# EAGLE schematic controller_unit (EAGLE 9.3.1)
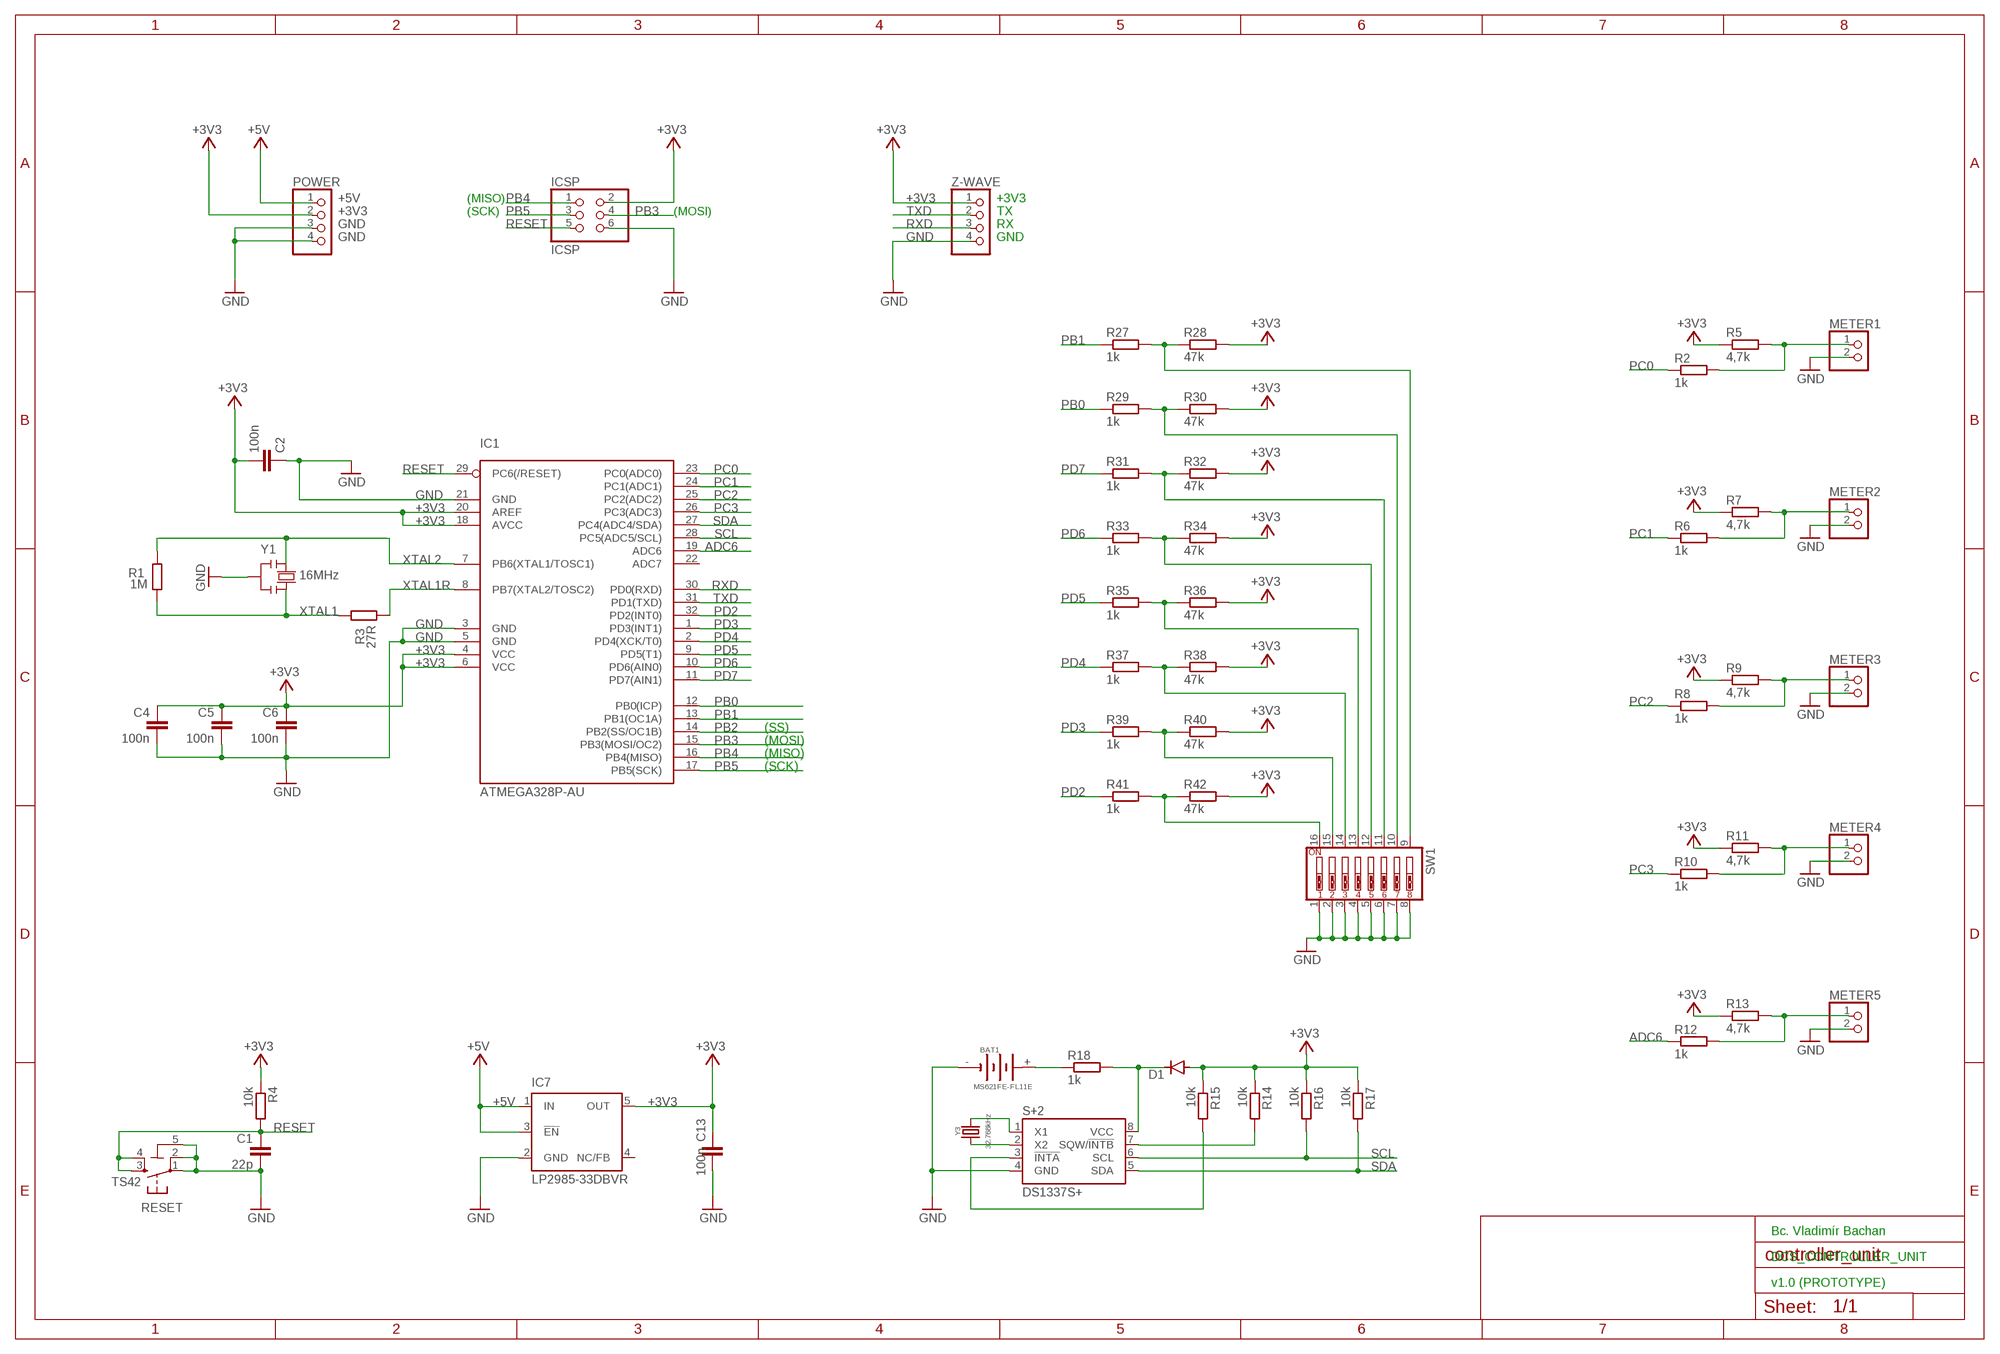
[diagram p0: schematic, sheet 1]

## Parts
BAT1  MS621FE-FL11E  [MS621FEFL11E]
C1  22p  C-EU0603-RND  [C0603-ROUND]
C2  100n  C-EU0603-RND  [C0603-ROUND]
C4  100n  C-EU0603-RND  [C0603-ROUND]
C5  100n  C-EU0603-RND  [C0603-ROUND]
C6  100n  C-EU0603-RND  [C0603-ROUND]
C13  100n  C-EU0603-RND  [C0603-ROUND]
D1  1N4148DO35-7  [DO35-7]
IC1  MEGA8-AI  [TQFP32-08]
IC7  LP2985-33DBVR  TPS77033  [SOT23-DBV]
ICSP  ICSP  PINHD-2X3  [2X03]
METER1  PINHD-1X2  [1X02]
METER2  PINHD-1X2  [1X02]
METER3  PINHD-1X2  [1X02]
METER4  PINHD-1X2  [1X02]
METER5  PINHD-1X2  [1X02]
POWER  PINHD-1X4  [1X04]
R1  1M  R-EU_R0603  [R0603-ROUND]
R2  1k  R-EU_0207/7  [0207/7]
R3  27R  R-EU_R0603  [R0603-ROUND]
R4  10k  R-EU_R0603  [R0603]
R5  4,7k  R-EU_0207/7  [0207/7]
R6  1k  R-EU_0207/7  [0207/7]
R7  4,7k  R-EU_0207/7  [0207/7]
R8  1k  R-EU_0207/7  [0207/7]
R9  4,7k  R-EU_0207/7  [0207/7]
R10  1k  R-EU_0207/7  [0207/7]
R11  4,7k  R-EU_0207/7  [0207/7]
R12  1k  R-EU_0207/7  [0207/7]
R13  4,7k  R-EU_0207/7  [0207/7]
R14  10k  R-EU_R0603  [R0603]
R15  10k  R-EU_R0603  [R0603]
R16  10k  R-EU_R0603  [R0603]
R17  10k  R-EU_R0603  [R0603]
R18  1k  R-EU_0207/7  [0207/7]
R27  1k  R-EU_0207/7  [0207/7]
R28  47k  R-EU_0207/7  [0207/7]
R29  1k  R-EU_0207/7  [0207/7]
R30  47k  R-EU_0207/7  [0207/7]
R31  1k  R-EU_0207/7  [0207/7]
R32  47k  R-EU_0207/7  [0207/7]
R33  1k  R-EU_0207/7  [0207/7]
R34  47k  R-EU_0207/7  [0207/7]
R35  1k  R-EU_0207/7  [0207/7]
R36  47k  R-EU_0207/7  [0207/7]
R37  1k  R-EU_0207/7  [0207/7]
R38  47k  R-EU_0207/7  [0207/7]
R39  1k  R-EU_0207/7  [0207/7]
R40  47k  R-EU_0207/7  [0207/7]
R41  1k  R-EU_0207/7  [0207/7]
R42  47k  R-EU_0207/7  [0207/7]
RESET  TS42  [TS42]
S+2  DS1337S+  [SO8]
SW1  SW_DIP-8  [EDG-08]
Y1  16MHz  RESONATORMU  [RESONATOR]
Y3  32.768kHz  CFPX–217  [CFPX–217]
Z-WAVE  PINHD-1X4  [1X04]

## Nets
#INTA_RTC: R15.2 S+2.3(!INTA)
+3V3: C2.2 C4.1 C5.1 C6.1 C13.2 D1.A IC1.4(VCC) IC1.6(VCC) IC1.18(AVCC) IC1.20(AREF) IC7.5(OUT) ICSP.2 POWER.2 R4.1 R5.1 R7.1 R9.1 R11.1 R13.1 R14.1 R15.1 R16.1 R17.1 R28.2 R30.2 R32.2 R34.2 R36.2 R38.2 R40.2 R42.2 Z-WAVE.1
+5V: IC7.1(IN) IC7.3(!EN) POWER.1
ADC6: IC1.19(ADC6) R12.1
GND: BAT1.- C1.2 C2.1 C4.2 C5.2 C6.2 C13.1 IC1.3(GND) IC1.5(GND) IC1.21(GND) IC7.2(GND) ICSP.6 METER1.2 METER2.2 METER3.2 METER4.2 METER5.2 POWER.3 POWER.4 RESET.1 RESET.2 RESET.5(5-GND) S+2.4(GND) SW1.1 SW1.2 SW1.3 SW1.4 SW1.5 SW1.6 SW1.7 SW1.8 Y1.2 Z-WAVE.4
N$1: METER1.1 R2.2 R5.2
N$2: METER2.1 R6.2 R7.2
N$3: METER3.1 R8.2 R9.2
N$4: METER4.1 R10.2 R11.2
N$5: METER5.1 R12.2 R13.2
N$6: S+2.2(X2) Y3.2
N$7: S+2.1(X1) Y3.1
N$8: R14.2 S+2.7(SQW/!INTB!)
N$9: BAT1.+ R18.1
N$10: D1.C R18.2 S+2.8(VCC)
N$22: R27.2 R28.1 SW1.9
N$23: R29.2 R30.1 SW1.10
N$24: R31.2 R32.1 SW1.11
N$25: R33.2 R34.1 SW1.12
N$26: R35.2 R36.1 SW1.13
N$27: R37.2 R38.1 SW1.14
N$28: R39.2 R40.1 SW1.15
N$29: R41.2 R42.1 SW1.16
PB0: IC1.12(PB0(ICP)) R29.1
PB1: IC1.13(PB1(OC1A)) R27.1
PB2: IC1.14(PB2(SS/OC1B))
PB3: IC1.15(PB3(MOSI/OC2)) ICSP.4
PB4: IC1.16(PB4(MISO)) ICSP.1
PB5: IC1.17(PB5(SCK)) ICSP.3
PC0: IC1.23(PC0(ADC0)) R2.1
PC1: IC1.24(PC1(ADC1)) R6.1
PC2: IC1.25(PC2(ADC2)) R8.1
PC3: IC1.26(PC3(ADC3)) R10.1
PD2: IC1.32(PD2(INT0)) R41.1
PD3: IC1.1(PD3(INT1)) R39.1
PD4: IC1.2(PD4(XCK/T0)) R37.1
PD5: IC1.9(PD5(T1)) R35.1
PD6: IC1.10(PD6(AIN0)) R33.1
PD7: IC1.11(PD7(AIN1)) R31.1
RESET: C1.1 IC1.29(PC6(/RESET)) ICSP.5 R4.2 RESET.3 RESET.4
RXD: IC1.30(PD0(RXD)) Z-WAVE.3
SCL: IC1.28(PC5(ADC5/SCL)) R16.2 S+2.6(SCL)
SDA: IC1.27(PC4(ADC4/SDA)) R17.2 S+2.5(SDA)
TXD: IC1.31(PD1(TXD)) Z-WAVE.2
XTAL1: R1.1 R3.2 Y1.3
XTAL1R: IC1.8(PB7(XTAL2/TOSC2)) R3.1
XTAL2: IC1.7(PB6(XTAL1/TOSC1)) R1.2 Y1.1
Unconnected: IC1.22(ADC7) IC7.4(NC/FB)

## Notes on the sheet
- (MISO) | +3V3
- (SCK) | (MOSI) | TX
- RX
- GND
- (SS)
- (MOSI)
- (MISO)
- (SCK)
- Bc. Vladimír Bachan
- DCS_CONTROLLER_UNIT
- v1.0 (PROTOTYPE)

## Library data of the parts
BAT1 = Battery:MS621FE-FL11E; FARNELL: 1614634
C1 C2 C4-C6 C13 = SmartPrj:C-EU: CAPACITOR, European symbol
D1 = diode:1N4148: DIODE high speed (Philips)
IC1 = atmel:MEGA8: MICROCONTROLLER 8 Kbytes FLASH, 1 kbytes SRAM, 512 bytes EEPROM, USART, 6-channel 10 bit ADC, 2-channel 8 bit ADC Pin compatible with Atmega48, ATMega88, ATMega168 Source: avr.lbr; MPN: ATMEGA328P-AU; OC_FARNELL: 1715486; OC_NEWARK: 73M8863
IC7 = texas:TPS770*: ULTRALOW-POWER 50-mA LOW-DROPOUT LINEAR REGULATORS 50-mA Low-Dropout Regulator Source: http://focus.ti.com/lit/ds/symlink/tps77001.pdf
ICSP = pinhead:PINHD-2X3: PIN HEADER
METER1-METER5 = pinhead:PINHD-1X2: PIN HEADER
POWER Z-WAVE = pinhead:PINHD-1X4: PIN HEADER
R1 R3 = SmartPrj:R-EU_: RESISTOR, European symbol
R2 R4-R18 R27-R42 = rcl:R-EU_: RESISTOR, European symbol; SPICEPREFIX: R
RESET = st-mod v1.4:TS42: TS42 Dongnan Electronics Tact switch VDC 12V - 50mA
S+2 = AjRTC:DS1337: DS1337 I2C serial real-time clock Low-power clock/calendar with two programmable time-of-day alarms and a programmable square-wave output. http://pdfserv.maxim-ic.com/en/ds/DS1337-DS1337C.pdf
SW1 = special:SW_DIP-8: DIP SWITCH
Y1 = SmartPrj:RESONATOR
Y3 = Crystals:CFPX–217; TME: CFPX-217